# EAGLE schematic E4m (EAGLE 7.6.0)
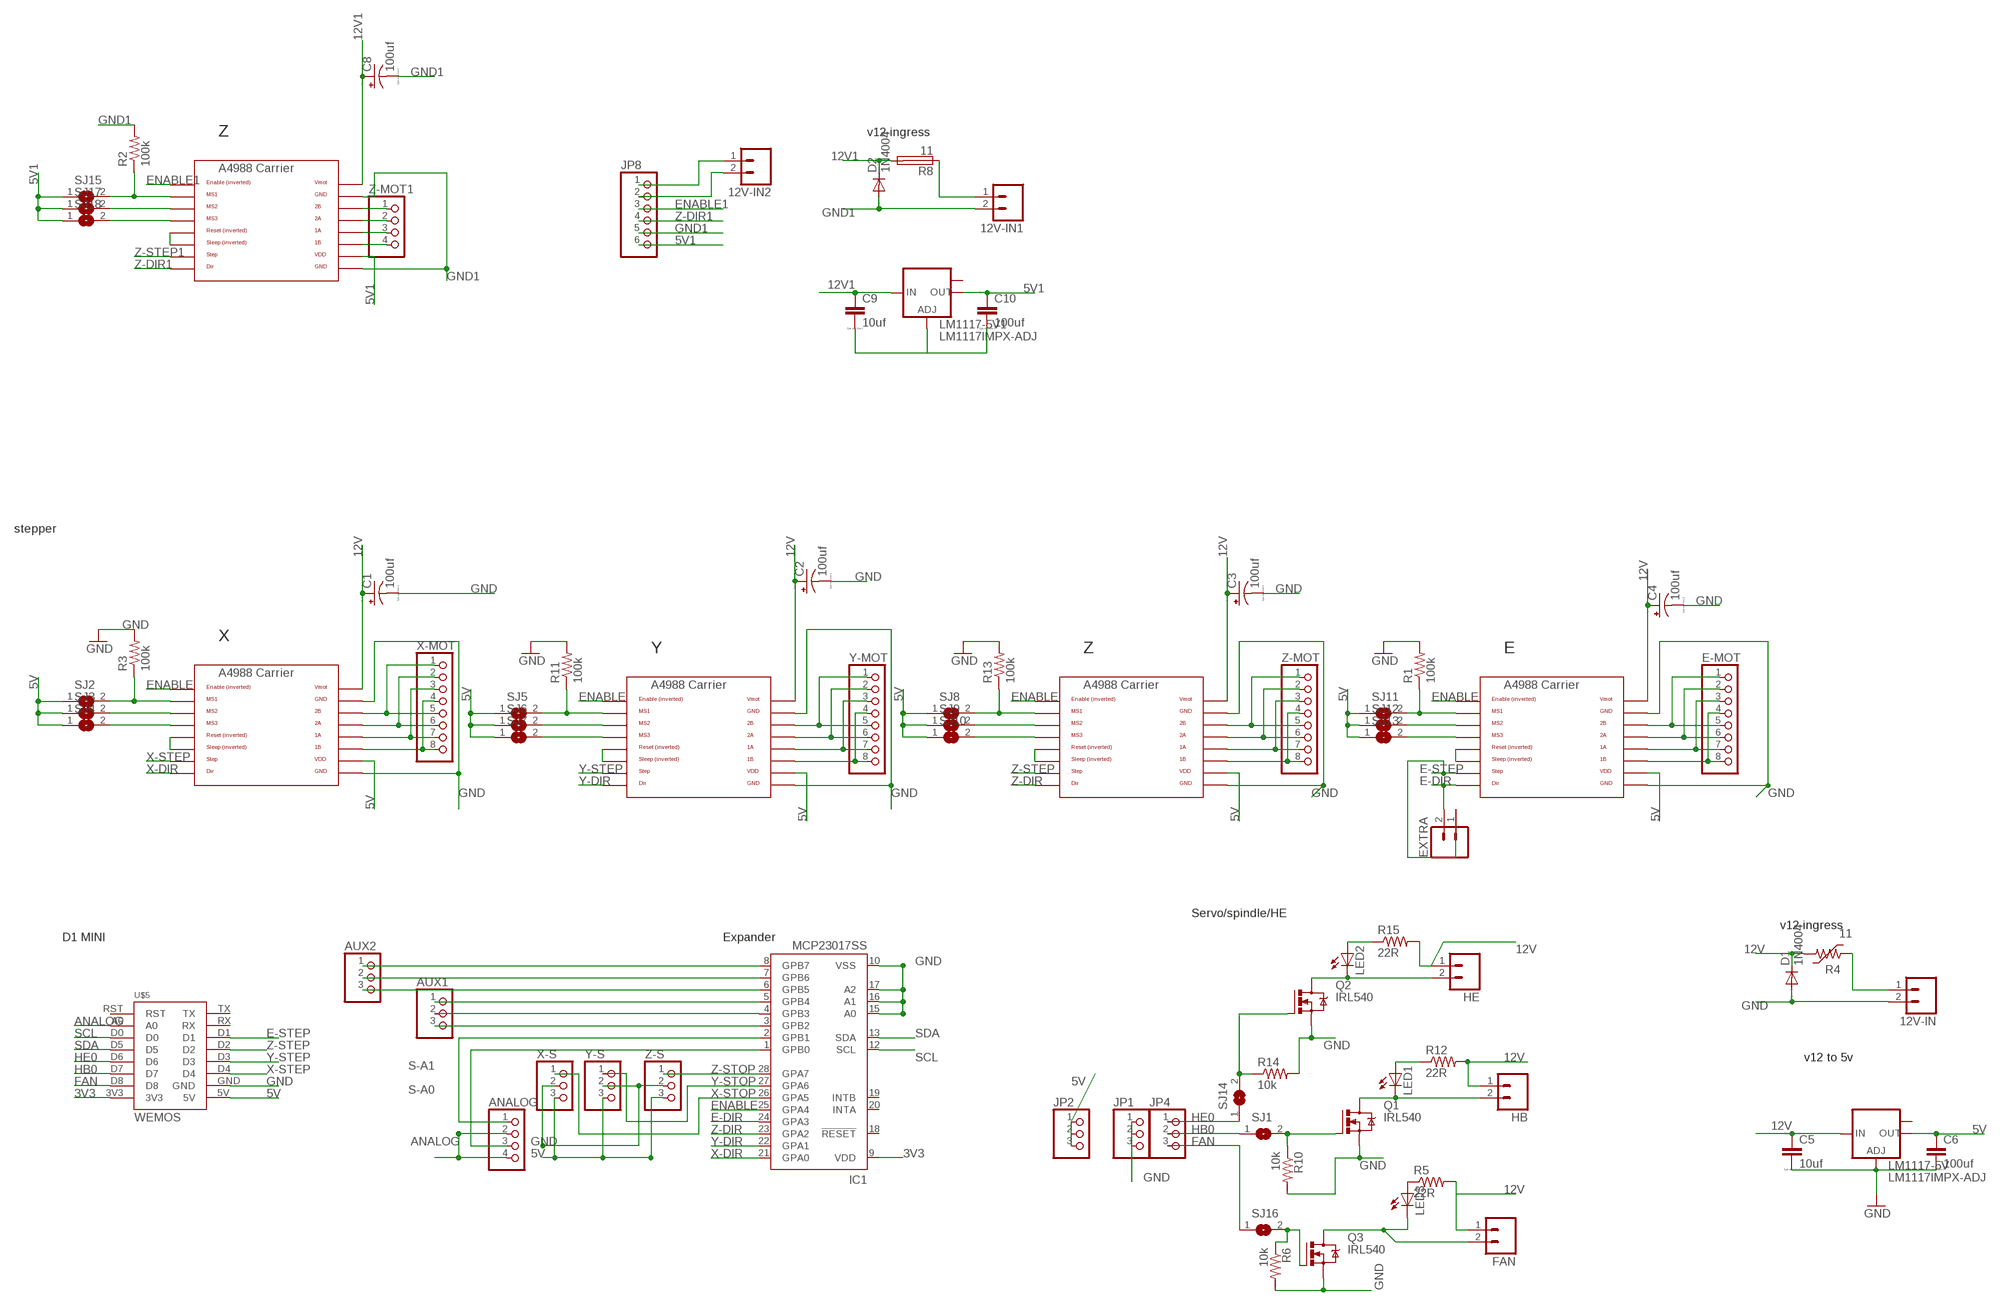
[diagram p0: schematic, sheet 1]

## Parts
12V-IN  M02PTH  [1X02]
12V-IN1  M02PTH  [1X02]
12V-IN2  M02PTH  [1X02]
ANALOG  PINHD-1X4  [1X04]
AUX1  PINHD-1X3CB  [1X03-CLEANBIG]
AUX2  PINHD-1X3CB  [1X03-CLEANBIG]
C1  100uf  CPOL-US153CLV-0605  [153CLV-0605]
C2  100uf  CPOL-US153CLV-0605  [153CLV-0605]
C3  100uf  CPOL-US153CLV-0605  [153CLV-0605]
C4  100uf  CPOL-US153CLV-0605  [153CLV-0605]
C5  10uf  C  [C0805]
C6  100uf  C  [C0805]
C8  100uf  CPOL-US153CLV-0605  [153CLV-0605]
C9  10uf  CC0603  [C0603]
C10  100uf  CC0603  [C0603]
D1  1N4004  [DO41-10]
D2  1N4004  [DO41-10]
E-MOT  PINHD-1X8CLEANBIG  [1X08-CLEANBIG]
EXTRA  M02PTH  [1X02]
FAN  M02PTH  [1X02]
HB  M02PTH  [1X02]
HE  M02PTH  [1X02]
IC1  MCP23017SS  [SSOP28]
JP1  PINHD-1X3CB  [1X03-CLEANBIG]
JP2  PINHD-1X3CB  [1X03-CLEANBIG]
JP4  PINHD-1X3CB  [1X03-CLEANBIG]
JP8  PINHD-1X6  [1X06]
LED1  LEDCHIP-LED0805  [CHIP-LED0805]
LED2  LEDCHIP-LED0805  [CHIP-LED0805]
LED3  LEDCHIP-LED0805  [CHIP-LED0805]
LM1117-5V  LM1117IMPX-ADJ  [SOT223]
LM1117-5V1  LM1117IMPX-ADJ  [SOT223]
Q1  IRL540  IRF540  [TO220BV]
Q2  IRL540  IRF540  [TO220BV]
Q3  IRL540  IRF540  [TO220BV]
R1  100k  R-US_R0805  [R0805]
R2  100k  R-US_R0805  [R0805]
R3  100k  R-US_R0805  [R0805]
R4  11  PTC-PF-8.0  [PF-8.0]
R5  22R  R-US_R0805  [R0805]
R6  10k  R-US_R0805  [R0805]
R8  11  PTCFUSE  [LITTLEFUSE]
R10  10k  R-US_R0805  [R0805]
R11  100k  R-US_R0805  [R0805]
R12  22R  R-US_R0805  [R0805]
R13  100k  R-US_R0805  [R0805]
R14  10k  R-US_R0805  [R0805]
R15  22R  R-US_R0805  [R0805]
SJ1  SJ  [SJ]
SJ2  SJ  [SJ]
SJ3  SJ  [SJ]
SJ4  SJ  [SJ]
SJ5  SJ  [SJ]
SJ6  SJ  [SJ]
SJ7  SJ  [SJ]
SJ8  SJ  [SJ]
SJ9  SJ  [SJ]
SJ10  SJ  [SJ]
SJ11  SJ  [SJ]
SJ12  SJ  [SJ]
SJ13  SJ  [SJ]
SJ14  SJ  [SJ]
SJ15  SJ  [SJ]
SJ16  SJ  [SJ]
SJ17  SJ  [SJ]
SJ18  SJ  [SJ]
U$1  A4988BREAKOUT  [A4988BREAKOUT]
U$2  A4988BREAKOUT  [A4988BREAKOUT]
U$3  A4988BREAKOUT  [A4988BREAKOUT]
U$5  WEMOS  [WEMOS]
U$6  A4988BREAKOUT  [A4988BREAKOUT]
U$9  A4988BREAKOUT  [A4988BREAKOUT]
X-MOT  PINHD-1X8CLEANBIG  [1X08-CLEANBIG]
X-S  PINHD-1X3CB  [1X03-CLEANBIG]
Y-MOT  PINHD-1X8CLEANBIG  [1X08-CLEANBIG]
Y-S  PINHD-1X3CB  [1X03-CLEANBIG]
Z-MOT  PINHD-1X8CLEANBIG  [1X08-CLEANBIG]
Z-MOT1  PINHD-1X4  [1X04]
Z-S  PINHD-1X3CB  [1X03-CLEANBIG]

## Nets
3V3: IC1.9(VDD) U$5.3V3
5V: C6.1 JP2.1 JP2.2 JP2.3 LM1117-5V.2(OUT) SJ2.1 SJ3.1 SJ4.1 SJ5.1 SJ6.1 SJ7.1 SJ8.1 SJ9.1 SJ10.1 SJ11.1 SJ12.1 SJ13.1 U$1.VDD U$2.VDD U$3.VDD U$5.5V U$9.VDD X-S.3 Y-S.3 Z-S.3
5V1: C10.1 JP8.6 LM1117-5V1.2(OUT) SJ15.1 SJ17.1 SJ18.1 U$6.VDD
12V [Power]: C1.+ C2.+ C3.+ C4.+ C5.1 D1.C FAN.1 HB.1 HE.1 LM1117-5V.3(IN) R4.2 R5.2 R12.2 R15.2 U$1.VMOT U$2.VMOT U$3.VMOT U$9.VMOT
12V1 [Power]: C8.+ C9.1 D2.C LM1117-5V1.3(IN) R8.2 U$6.VMOT
ANALOG: ANALOG.2 ANALOG.4 U$5.A0
AUX2: AUX2.1 IC1.8(GPB7)
E-DIR: EXTRA.2 IC1.24(GPA3) U$2.DIR
E-STEP: EXTRA.1 U$2.STEP U$5.D1
ENABLE: IC1.25(GPA4) U$1.EN U$2.EN U$3.EN U$9.EN
ENABLE1: JP8.3 U$6.EN
FAN: JP4.3 SJ16.1 U$5.D8
GND: 12V-IN.2 C1.- C2.- C3.- C4.- C5.2 C6.2 D1.A IC1.10(VSS) IC1.15(A0) IC1.16(A1) IC1.17(A2) JP1.1 JP1.2 JP1.3 LM1117-5V.1(ADJ) Q1.S Q2.S Q3.S R1.2 R3.2 R6.2 R10.2 R11.2 R13.2 R14.2 U$1.GND U$1.GND@0(GND) U$2.GND U$2.GND@0(GND) U$3.GND U$3.GND@0(GND) U$5.GND U$9.GND U$9.GND@0(GND) X-S.2 Y-S.2 Z-S.2
GND1: 12V-IN1.2 C8.- D2.A JP8.5 R2.2 U$6.GND U$6.GND@0(GND)
HB0: JP4.2 SJ1.1 U$5.D7
HE0: JP4.1 SJ14.1 U$5.D6
N$1: LED3.A R5.1
N$3: AUX2.2 IC1.7(GPB6)
N$4: SJ12.2 U$2.MS2
N$5: U$2.RST U$2.SLP(SLEEP)
N$6: SJ13.2 U$2.MS3
N$7: R1.1 SJ11.2 U$2.MS1
N$8 [line]: U$3.1B Y-MOT.4 Y-MOT.8
N$9 [line]: U$3.1A Y-MOT.3 Y-MOT.7
N$10: U$3.2A Y-MOT.2 Y-MOT.6
N$11 [line]: U$3.2B Y-MOT.1 Y-MOT.5
N$12 [line]: U$1.1B X-MOT.4 X-MOT.8
N$13 [Power]: HB.2 LED1.C Q1.D
N$14 [line]: U$1.1A X-MOT.3 X-MOT.7
N$15: U$1.2A X-MOT.2 X-MOT.6
N$16 [line]: U$1.2B X-MOT.1 X-MOT.5
N$17 [line]: U$9.1B Z-MOT.4 Z-MOT.8
N$18: FAN.2 LED3.C Q3.D
N$19: AUX1.3 IC1.3(GPB2)
N$20 [line]: U$9.1A Z-MOT.3 Z-MOT.7
N$21: AUX2.3 IC1.6(GPB5)
N$22: AUX1.1 IC1.5(GPB4)
N$23: Q2.G R14.1 SJ14.2
N$24: SJ3.2 U$1.MS2
N$25: U$9.RST U$9.SLP(SLEEP)
N$26: AUX1.2 IC1.4(GPB3)
N$27: Q3.G R6.1 SJ16.2
N$28: U$3.RST U$3.SLP(SLEEP)
N$29: U$1.RST U$1.SLP(SLEEP)
N$30 [Power]: 12V-IN.1 R4.1
N$34: SJ4.2 U$1.MS3
N$35: R3.1 SJ2.2 U$1.MS1
N$37: SJ17.2 U$6.MS2
N$39: SJ18.2 U$6.MS3
N$40: R2.1 SJ15.2 U$6.MS1
N$41 [line]: U$6.2B Z-MOT1.1
N$42 [line]: U$6.2A Z-MOT1.2
N$43 [line]: U$6.1A Z-MOT1.3
N$44 [line]: U$6.1B Z-MOT1.4
N$45: U$6.RST U$6.SLP(SLEEP)
N$46: U$9.2A Z-MOT.2 Z-MOT.6
N$47 [Power]: 12V-IN1.1 R8.1
N$48 [line]: U$9.2B Z-MOT.1 Z-MOT.5
N$49: C9.2 C10.2 LM1117-5V1.1(ADJ)
N$50 [line]: E-MOT.4 E-MOT.8 U$2.1B
N$51 [line]: E-MOT.3 E-MOT.7 U$2.1A
N$52: 12V-IN2.2 JP8.2
N$53: 12V-IN2.1 JP8.1
N$54: LED1.A R12.1
N$55: E-MOT.2 E-MOT.6 U$2.2A
N$56: SJ6.2 U$3.MS2
N$57 [Power]: HE.2 LED2.C Q2.D
N$58: SJ7.2 U$3.MS3
N$59: R11.1 SJ5.2 U$3.MS1
N$60 [line]: E-MOT.1 E-MOT.5 U$2.2B
N$64: SJ9.2 U$9.MS2
N$65: LED2.A R15.1
N$66: SJ10.2 U$9.MS3
N$67: R13.1 SJ8.2 U$9.MS1
N$S4: Q1.G R10.1 SJ1.2
S-A0: ANALOG.3 IC1.1(GPB0)
S-A1: ANALOG.1 IC1.2(GPB1)
SCL: IC1.12(SCL) U$5.D0
SDA: IC1.13(SDA) U$5.D5
X-DIR: IC1.21(GPA0) U$1.DIR
X-STEP: U$1.STEP U$5.D4
X-STOP: IC1.26(GPA5) X-S.1
Y-DIR: IC1.22(GPA1) U$3.DIR
Y-STEP: U$3.STEP U$5.D3
Y-STOP: IC1.27(GPA6) Y-S.1
Z-DIR: IC1.23(GPA2) U$9.DIR
Z-DIR1: JP8.4 U$6.DIR
Z-STEP: U$5.D2 U$9.STEP
Z-STEP1: U$6.STEP
Z-STOP: IC1.28(GPA7) Z-S.1
Unconnected: IC1.18(!RESET) IC1.19(INTB) IC1.20(INTA) LM1117-5V1.TAB(OUT1) LM1117-5V.TAB(OUT1) U$5.RST U$5.RX U$5.TX

## Notes on the sheet
- Z | v12 ingress
- stepper
- X
- Y | Z | E
- Servo/spindle/HE
- v12 ingress
- D1 MINI | Expander
- v12 to 5v

## Library data of the parts
12V-IN 12V-IN1 12V-IN2 EXTRA FAN HB HE = SparkFun:M02: Header 2 Standard 2-pin 0.1" header. Use with straight break away headers (SKU : PRT-00116), right angle break away headers (PRT-00553), swiss pins (PRT-00743), machine pins (PRT-00117), and female headers (PRT-00115). Molex polarized connector foot print use with SKU : PRT-08233 with associated crimp pins and housings.
ANALOG Z-MOT1 = RepRapjr:PINHD-1X4: PIN HEADER
AUX1 AUX2 JP1 JP2 JP4 X-S Y-S Z-S = adafruit:PINHD-1X3: PIN HEADER
C1-C4 C8 = resistor:CPOL-US: POLARIZED CAPACITOR, American symbol
C5 C6 C9 C10 = eagle-ltspice:C: CAPACITOR, European symbol; SPICEMODEL: NONE; SPICEPREFIX: C
D1 D2 = diode:1N4004: DIODE general purpose rectifier, 1 A
E-MOT X-MOT Y-MOT Z-MOT = adafruit:PINHD-1X8: PIN HEADER
IC1 = adafruit:MCP23017: http://ww1.microchip.com/downloads/en/DeviceDoc/21952a.pdf Source: http://ww1.microchip.com/downloads/en/DeviceDoc/21952a.pdf
JP8 = adafruit:PINHD-1X6: PIN HEADER
LED1-LED3 = RepRapjr:LED: LED OSRAM: - CHIPLED LG R971, LG N971, LY N971, LG Q971, LY Q971, LO R971, LY R971 LH N974, LH R974 LS Q976, LO Q976, LY Q976 LO Q996 - Hyper CHIPLED LW Q18S LB Q993, LB Q99A, LB R99A - SideLED LS A670, LO A670, LY A670, LG A670, LP A670 LB A673, LV A673, LT A673, LW A673 LH A674 LY A675 LS A676, LA A676, LO A676, LY A676, LW A676 LS A679, LY A679, LG A679 - Hyper Micro SIDELED® LS Y876, LA Y876, LO Y876, LY Y876 LT Y87S - SmartLED LW L88C, LW L88S LB L89C, LB L89S, LG L890 LS L89K, LO L89K, LY L89K LS L896, LA L896, LO L896, LY L896 - TOPLED LS T670, LO T670, LY T670, LG T670, LP T670 LSG T670, LSP T670, LSY T670, LOP T670, LYG T670 LG T671, LOG T671, LSG T671 LB T673, LV T673, LT T673, LW T673 LH T674 LS T676, LA T676, LO T676, LY T676, LB T676, LH T676, LSB T676, LW T676 LB T67C, LV T67C, LT T67C, LS T67K, LO T67K, LY T67K, LW E67C LS E67B, LA E67B, LO E67B, LY E67B, LB E67C, LV E67C, LT E67C LW T67C LS T679, LY T679, LG T679 LS T770, LO T770, LY T770, LG T770, LP T770 LB T773, LV T773, LT T773, LW T773 LH T774 LS E675, LA E675, LY E675, LS T675 LS T776, LA T776, LO T776, LY T776, LB T776 LHGB T686 LT T68C, LB T68C - Hyper Mini TOPLED® LB M676 - Mini TOPLED Santana® LG M470 LS M47K, LO M47K, LY M47K Source: http://www.osram.convergy.de LUXEON: - LUMILED® LXK2-PW12-R00, LXK2-PW12-S00, LXK2-PW14-U00, LXK2-PW14-V00 LXK2-PM12-R00, LXK2-PM12-S00, LXK2-PM14-U00 LXK2-PE12-Q00, LXK2-PE12-R00, LXK2-PE12-S00, LXK2-PE14-T00, LXK2-PE14-U00 LXK2-PB12-K00, LXK2-PB12-L00, LXK2-PB12-M00, LXK2-PB14-N00, LXK2-PB14-P00, LXK2-PB14-Q00 LXK2-PR12-L00, LXK2-PR12-M00, LXK2-PR14-Q00, LXK2-PR14-R00 LXK2-PD12-Q00, LXK2-PD12-R00, LXK2-PD12-S00 LXK2-PH12-R00, LXK2-PH12-S00 LXK2-PL12-P00, LXK2-PL12-Q00, LXK2-PL12-R00 Source: www.luxeon.com KINGBRIGHT: KA-3528ASYC Source: www.kingbright.com
LM1117-5V LM1117-5V1 = lm1117:LM1117IMPX-ADJ
Q1-Q3 = smootietransistor-power:IRF540: HEXFET Power MOSFET
R1-R3 R5 R6 R10-R15 = adafruit:R-US_: RESISTOR, American symbol
R4 = polyswitch:PTC-: POLYSWITCH Polyswitch Resetable Fuses
R8 = RepRapjr:PTCFUSE: LITTLEFUSE Picofuse/slow Littlefuse
SJ1-SJ18 = jumper:SJ: SMD solder JUMPER
U$1-U$3 U$6 U$9 = RepRapjr:A4988BREAKOUT
U$5 = 1455413453956-wemos:WEMOS

## Net classes
1 Power: width 0.8 mm
2 line: width 0.4 mm